# Altium project PR003.PrjPcb (part 7 of 11)

## Sheet Audio_CodeC.SchDoc
size A3; SheetNumber: 13; SheetTotal: 16
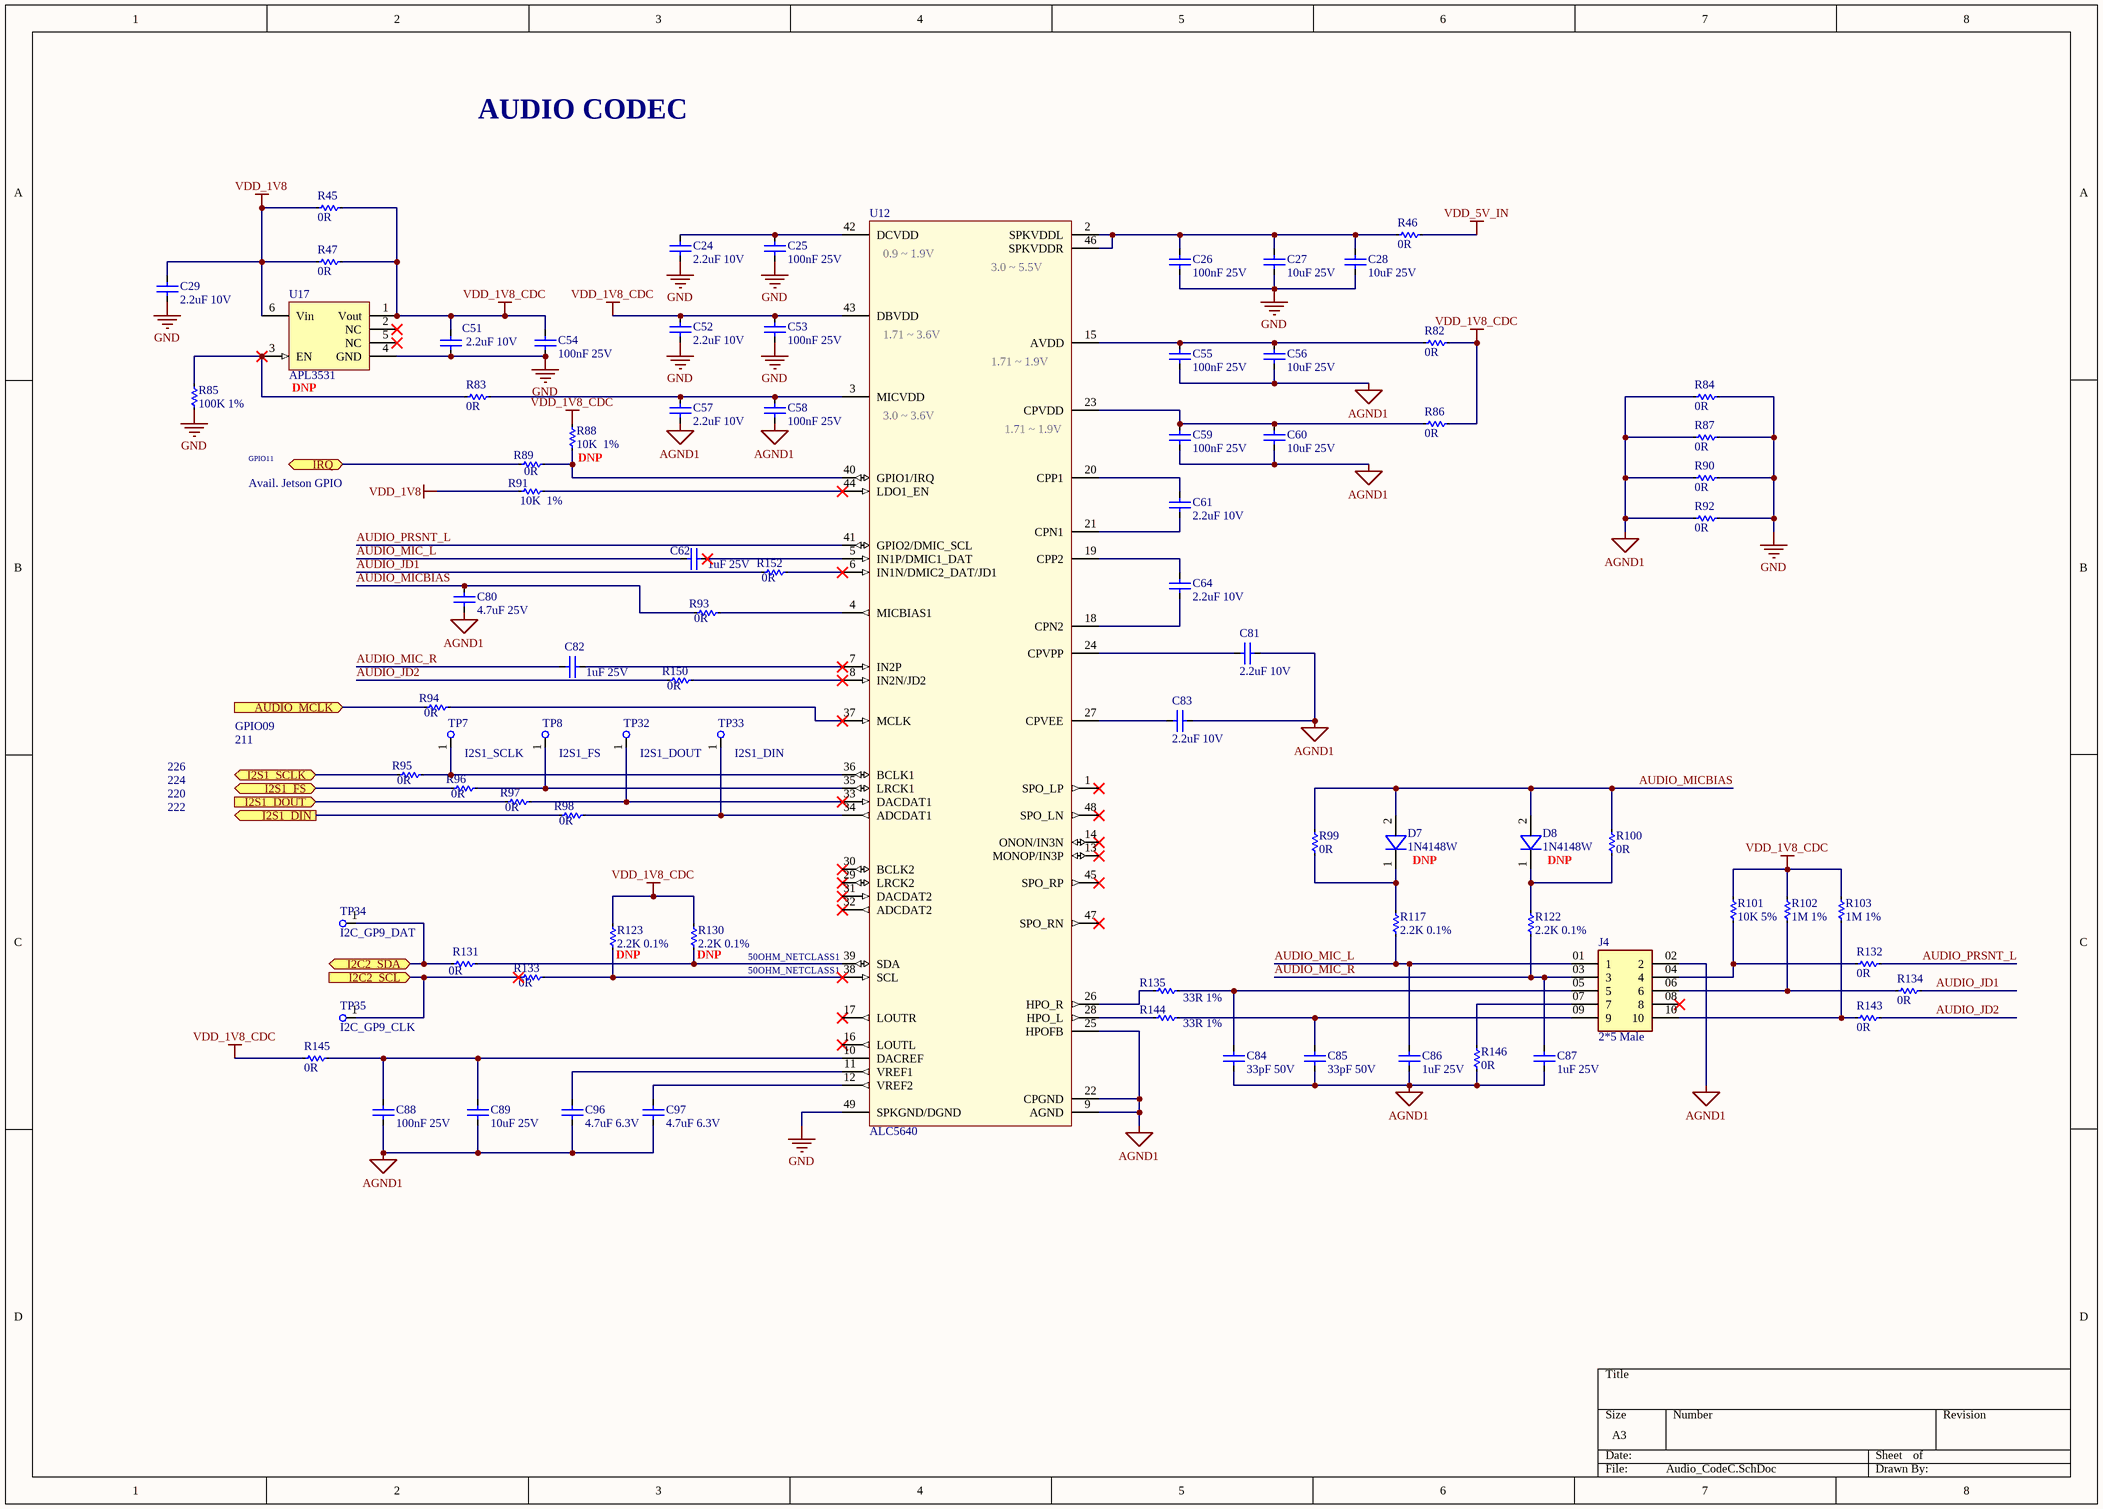
[diagram p9: Audio_CodeC.SchDoc]

### Parts
C24  2.2uF 10V  [C0402]
C25  100nF 25V  [C0402]
C26  100nF 25V  [C0402]
C27  10uF 25V  [C0805]
C28  10uF 25V  [C0805]
C29  2.2uF 10V  [C0402]
C51  2.2uF 10V  [C0402]
C52  2.2uF 10V  [C0402]
C53  100nF 25V  [C0402]
C54  100nF 25V  [C0402]
C55  100nF 25V  [C0402]
C56  10uF 25V  [C0805]
C57  2.2uF 10V  [C0402]
C58  100nF 25V  [C0402]
C59  100nF 25V  [C0402]
C60  10uF 25V  [C0805]
C61  2.2uF 10V  [C0402]
C62  1uF 25V  [C0402]
C64  2.2uF 10V  [C0402]
C80  4.7uF 25V  [C0603]
C81  2.2uF 10V  [C0402]
C82  1uF 25V  [C0402]
C83  2.2uF 10V  [C0402]
C84  33pF 50V  [C0402]
C85  33pF 50V  [C0402]
C86  1uF 25V  [C0402]
C87  1uF 25V  [C0402]
C88  100nF 25V  [C0402]
C89  10uF 25V  [C0805]
C96  4.7uF 6.3V  [C0402]
C97  4.7uF 6.3V  [C0402]
D7  1N4148W  [SOD123F]
D8  1N4148W  [SOD123F]
J4  2*5 Male  [0010977106]
R45  0R  [R0603]
R46  0R  [R0603]
R47  0R  [R0603]
R82  0R  [R0603]
R83  0R  [R0402]
R84  0R  [R0805]
R85  100K 1%  [R0402]
R86  0R  [R0603]
R87  0R  [R0805]
R88  10K  1%  [R0402]
R89  0R  [R0603]
R90  0R  [R0805]
R91  10K  1%  [R0402]
R92  0R  [R0805]
R93  0R  [R0603]
R94  0R  [R0603]
R95  0R  [R0603]
R96  0R  [R0603]
R97  0R  [R0603]
R98  0R  [R0603]
R99  0R  [R0402]
R100  0R  [R0402]
R101  10K 5%  [R0402]
R102  1M 1%  [R0402]
R103  1M 1%  [R0402]
R117  2.2K 0.1%  [R0603]
R122  2.2K 0.1%  [R0603]
R123  2.2K 0.1%  [R0603]
R130  2.2K 0.1%  [R0603]
R131  0R  [R0603]
R132  0R  [R0402]
R133  0R  [R0603]
R134  0R  [R0402]
R135  33R 1%  [R0402]
R143  0R  [R0402]
R144  33R 1%  [R0402]
R145  0R  [R0603]
R146  0R  [R0402]
R150  0R  [R0603]
R152  0R  [R0603]
TP7  I2S1_SCLK  [TestPoint_Pad_D1.0mm]
TP8  I2S1_FS  [TestPoint_Pad_D1.0mm]
TP32  I2S1_DOUT  [TestPoint_Pad_D1.0mm]
TP33  I2S1_DIN  [TestPoint_Pad_D1.0mm]
TP34  I2C_GP9_DAT  [TestPoint_Pad_D1.0mm]
TP35  I2C_GP9_CLK  [TestPoint_Pad_D1.0mm]
U12  ALC5640  [QFN-48 6mm*6mm]
U17  APL3531  [SC-70-6]

### Ports
AUDIO_MCLK (in), I2C2_SCL (in), I2C2_SDA (bidir), I2S1_DIN (out), I2S1_DOUT (in), I2S1_FS (bidir), I2S1_SCLK (bidir), IRQ (bidir)

### Nets
AGND1: C55.1 C56.1 C57.1 C58.1 C59.1 C60.1 C80.1 C81.1 C83.1 C84.1 C85.1 C86.1 C87.1 C88.1 C89.1 C96.1 C97.1 J4.02(2) R84.1 R87.1 R90.1 R92.1 R146.1 U12.9(AGND) U12.22(CPGND) U12.25(HPOFB)
GND: C24.1 C25.1 C26.1 C27.1 C28.1 C29.1 C51.1 C52.1 C53.1 C54.1 R84.2 R85.1 R87.2 R90.2 R92.2 U12.49(SPKGND/DGND) U17.4(GND)
VDD_1V8: C29.2 R45.1 R47.1 R91.2 U17.6(Vin)
VDD_1V8_CDC: C51.2 C52.2 C53.2 C54.2 R45.2 R47.2 R82.2 R86.2 R88.2 R101.2 R102.2 R103.2 R123.2 R130.2 R145.1 U12.43(DBVDD) U17.1(Vout)
VDD_5V_IN: R46.2
AUDIO_JD1: R134.2 R152.1
AUDIO_JD2: R143.2 R150.1
AUDIO_MIC_L: C62.2 C86.2 J4.01(1) R117.1
AUDIO_MIC_R: C82.2 C87.2 J4.03(3) R122.1
AUDIO_MICBIAS: C80.2 D7.2(A) D8.2(A) R93.1 R99.2 R100.2
AUDIO_PRSNT_L: R132.2 U12.41(GPIO2/DMIC_SCL)
I2C2_SCL: R133.1 TP35.1 ; port I2C2_SCL
I2C2_SDA: R131.1 TP34.1 ; port I2C2_SDA
NetC24_2: C24.2 C25.2 U12.42(DCVDD)
NetC26_2: C26.2 C27.2 C28.2 R46.1 U12.2(SPKVDDL) U12.46(SPKVDDR)
NetC55_2: C55.2 C56.2 R82.1 U12.15(AVDD)
NetC57_2: C57.2 C58.2 R83.2 U12.3(MICVDD)
NetC59_2: C59.2 C60.2 R86.1 U12.23(CPVDD)
NetC61_1: C61.1 U12.21(CPN1)
NetC61_2: C61.2 U12.20(CPP1)
NetC62_1: C62.1 U12.5(IN1P/DMIC1_DAT)
NetC64_1: C64.1 U12.18(CPN2)
NetC64_2: C64.2 U12.19(CPP2)
NetC81_2: C81.2 U12.24(CPVPP)
NetC82_1: C82.1 U12.7(IN2P)
NetC83_2: C83.2 U12.27(CPVEE)
NetC84_2: C84.2 J4.05(5) R135.2
NetC85_2: C85.2 J4.09(9) R144.2
NetC88_2: C88.2 C89.2 R145.2 U12.10(DACREF)
NetC96_2: C96.2 U12.11(VREF1)
NetC97_2: C97.2 U12.12(VREF2)
NetD7_1: D7.1(K) R99.1 R117.2
NetD8_1: D8.1(K) R100.1 R122.2
NetJ4_04: J4.04(4) R101.1 R132.1
NetJ4_06: J4.06(6) R102.1 R134.1
NetJ4_07: J4.07(7) R146.2
NetJ4_10: J4.10 R103.1 R143.1
NetJ10_211: R94.1 ; port AUDIO_MCLK
NetJ10_216: R89.1 ; port IRQ
NetJ10_220: R97.1 ; port I2S1_DOUT
NetJ10_222: R98.1 ; port I2S1_DIN
NetJ10_224: R96.1 ; port I2S1_FS
NetJ10_226: R95.1 ; port I2S1_SCLK
NetR83_1: R83.1 R85.2 U17.3(EN)
NetR88_1: R88.1 R89.2 U12.40(GPIO1/IRQ)
NetR91_1: R91.1 U12.44(LDO1_EN)
NetR93_2: R93.2 U12.4(MICBIAS1)
NetR94_2: R94.2 U12.37(MCLK)
NetR95_2: R95.2 TP7.1 U12.36(BCLK1)
NetR96_2: R96.2 TP8.1 U12.35(LRCK1)
NetR97_2: R97.2 TP32.1 U12.33(DACDAT1)
NetR98_2: R98.2 TP33.1 U12.34(ADCDAT1)
NetR123_1: R123.1 R133.2 U12.38(SCL)
NetR130_1: R130.1 R131.2 U12.39(SDA)
NetR135_1: R135.1 U12.26(HPO_R)
NetR144_1: R144.1 U12.28(HPO_L)
NetR150_2: R150.2 U12.8(IN2N/JD2)
NetR152_2: R152.2 U12.6(IN1N/DMIC2_DAT/JD1)

Not connected (* = marked no-connect by the designer): J4 08(8)*; U12 1(SPO_LP)* 13(MONOP/IN3P)* 14(ONON/IN3N)* 16(LOUTL)* 17(LOUTR)* 29(LRCK2)* 30(BCLK2)* 31(DACDAT2)* 32(ADCDAT2)* 45(SPO_RP)* 47(SPO_RN)* 48(SPO_LN)*; U17 2(NC)* 5(NC)*

### Notes on the sheet
- AUDIO CODEC
- (near U17) DNP
- Avail. Jetson GPIO
- GPIO11
- (near R88) DNP
- 226
- 224
- GPIO09
- 211
- 220
- 222
- (near D7) DNP
- (near D8) DNP
- (near R123) DNP
- (near R130) DNP
- 50OHM_NETCLASS1
- (in symbol ALC5640) 0.9 ~ 1.9V; 3.0 ~ 5.5V; 1.71 ~ 3.6V; 1.71 ~ 1.9V; 3.0 ~ 3.6V

### Library data of the parts
C24 C29 C51 C52 C57 C61 C64 C81 C83 = CC0402MRX5R6BB225: 0402 2.2 uF 10 V ±20% Tolerance X5R Multilayer Ceramic Capacitor; Manufacturer: Yageo; Supplier 1: Digi-Key; Manufacturer Part Number: CC0402MRX5R6BB225; RoHS: Yes; Category: Ceramic Capacitors; Stock 1: 190957; Pricing 1: 1=0.10000, 10=0.06400, 50=0.03520, 100=0.02870, 500=0.02050, 1000=0.01611, 2500=0.01464, 5000=0.01347 (USD); Mount: Surface Mount; Case/Package: 0402; Case Code (Metric): 1005; Case Code (Imperial): 0402; Weight: 2.3E-05oz; Min Operating Temperature: -55°C; Max Operating Temperature: 85°C; Packaging: Tape and Reel; Capacitance: 2.2uF; Voltage Rating: 10V; Tolerance: 20%; Dielectric: X5R; Termination: SMD/SMT; Voltage Rating (DC): 10V; Package Quantity: 5000; Length: 0.039inch; Width: 0.02inch; Thickness: 0.022inch; Lead Free: Lead Free; Halogen Free: Halogen Free; RoHS Compliant: Yes; ComponentLink1URL: http://www.mouser.com/ds/2/447/Yageo_UPY-GP_NP0_16V-to-50V_9-358835.pdf?src-supplier=Mouser; ComponentLink1Description: http://www.mouser.com/ds/2/447/Yageo_UPY-GP_NP0_16V-to-50V_9-358835.pdf?src-supplier=Mouser; ComponentLink2URL: http://www.yageo.com/documents/recent/UPY-GPHC_X5R_4V-to-50V_25.pdf?src-supplier=Digi-Key; ComponentLink2Description: http://www.yageo.com/documents/recent/UPY-GPHC_X5R_4V-to-50V_25.pdf?src-supplier=Digi-Key; ComponentLink3URL: https://www.yageo.com/upload/media/product/productsearch/datasheet/mlcc/UPY-GPHC_X5R_4V-to-50V_26.pdf?src-supplier=Digi-Key; ComponentLink3Description: https://www.yageo.com/upload/media/product/productsearch/datasheet/mlcc/UPY-GPHC_X5R_4V-to-50V_26.pdf?src-supplier=Digi-Key; ComponentLink4URL: http://www.yageo.com/exep/pages/download/literatures/ProductSelectionGuide%202014_Final_2.pdf?src-supplier=Digi-Key; ComponentLink4Description: http://www.yageo.com/exep/pages/download/literatures/ProductSelectionGuide%202014_Final_2.pdf?src-supplier=Digi-Key; Supplier Part Number 1: 311-1733-6-ND
C25 C26 C53-C55 C58 C59 = 04023C104KAT2A: as C34 on sheet HDMI_Connector; Supplier 1: Digi-Key; Manufacturer Part Number: 04023C104KAT2A; RoHS: Yes; Category: Ceramic Capacitors; Stock 1: 3248475; Pricing 1: 1=0.10000, 10=0.03300, 50=0.01820, 100=0.01480, 500=0.01060, 1000=0.00833, 2500=0.00758, 5000=0.00697 (USD); Mount: Surface Mount; Case/Package: 0402; Number of Pins: 2; Case Code (Metric): 1005; Case Code (Imperial): 0402; Min Operating Temperature: -55°C; Max Operating Temperature: 125°C; Capacitance: 100nF; Packaging: Cut Tape; Dielectric: X7R; Voltage Rating (DC): 25V; Voltage Rating: 25V; Package Quantity: 1; Termination: SMD/SMT; Voltage: 25V; Series: -; Construction: Flat; Length: 1mm; Width: 1mm; Thickness: 0.022inch; Depth: 0.5mm; Radiation Hardening: No; Reach SVHC Compliant: Yes; Lead Free: Lead Free; RoHS Compliant: Yes; ComponentLink1URL: https://datasheet.ciiva.com/1123/1679506-1123344.pdf?src-supplier=Element14; ComponentLink1Description: https://datasheet.ciiva.com/1123/1679506-1123344.pdf?src-supplier=Element14; ComponentLink2URL: https://datasheet.ciiva.com/7614/cx7r-7614663.pdf?src-supplier=Digi-Key; ComponentLink2Description: https://datasheet.ciiva.com/7614/cx7r-7614663.pdf?src-supplier=Digi-Key; ComponentLink3URL: https://datasheet.ciiva.com/7709/1679506-7709527.pdf?src-supplier=Element14; ComponentLink3Description: https://datasheet.ciiva.com/7709/1679506-7709527.pdf?src-supplier=Element14; ComponentLink4URL: https://datasheet.ciiva.com/6265/cx7r-6265272.pdf?src-supplier=Digi-Key; ComponentLink4Description: https://datasheet.ciiva.com/6265/cx7r-6265272.pdf?src-supplier=Digi-Key; ComponentLink5URL: https://datasheet.ciiva.com/14906/cx7r-14906223.pdf?src-supplier=Digi-Key; ComponentLink5Description: https://datasheet.ciiva.com/14906/cx7r-14906223.pdf?src-supplier=Digi-Key; Supplier Part Number 1: 478-7868-1-ND
C27 C28 C56 C60 = TMK212BBJ106KG-T: as C36 on sheet HDMI_Connector; Supplier 1: Digi-Key; Manufacturer Part Number: TMK212BBJ106KG-T; RoHS: Yes; Category: Ceramic Capacitors; Stock 1: 3515248; Pricing 1: 1=0.18000, 10=0.12400, 50=0.07460, 100=0.06290, 500=0.04306, 1000=0.03810 (USD); Mount: Surface Mount; Case/Package: 0805; Number of Pins: 2; Case Code (Metric): 2012; Case Code (Imperial): 0805; Min Operating Temperature: -55°C; Max Operating Temperature: 85°C; Capacitance: 10uF; Tolerance: 10%; Packaging: Tape and Reel; Voltage Rating (DC): 25V; Package Quantity: 1; Voltage Rating: 25V; Termination: SMD/SMT; Resistor Type: Ceramic; Series: M; Length: 0.079inch; Width: 0.049inch; Height: 1.25mm; Thickness: 0.053inch; Lead Free: Lead Free; Reach SVHC Compliant: Yes; RoHS Compliant: Yes; ComponentLink1URL: https://datasheet.ciiva.com/30062/tmk212bbj106kg-t-30062083.pdf?src-supplier=Onlinecomponents.com; ComponentLink1Description: https://datasheet.ciiva.com/30062/tmk212bbj106kg-t-30062083.pdf?src-supplier=Onlinecomponents.com; ComponentLink2URL: https://datasheet.ciiva.com/7975/1481447-7975820.pdf?src-supplier=Element14; ComponentLink2Description: https://datasheet.ciiva.com/7975/1481447-7975820.pdf?src-supplier=Element14; ComponentLink3URL: https://datasheet.ciiva.com/139/mlcc-all-e-139571.pdf?src-supplier=Digi-Key; ComponentLink3Description: https://datasheet.ciiva.com/139/mlcc-all-e-139571.pdf?src-supplier=Digi-Key; ComponentLink4URL: https://datasheet.ciiva.com/139/mlcc-all-e-139570.pdf?src-supplier=Digi-Key; ComponentLink4Description: https://datasheet.ciiva.com/139/mlcc-all-e-139570.pdf?src-supplier=Digi-Key; ComponentLink5URL: https://datasheet.ciiva.com/139/mlcc-all-e-139572.pdf?src-supplier=Digi-Key; ComponentLink5Description: https://datasheet.ciiva.com/139/mlcc-all-e-139572.pdf?src-supplier=Digi-Key; Supplier Part Number 1: 587-2985-1-ND
C62 C82 C86 C87 = GRM155R61E105MA12D: 0402 1 uF 25 V ±20% Tolerance X5R SMT Multilayer Ceramic Capacitor; Manufacturer: Murata; Supplier 1: Digi-Key; Manufacturer Part Number: GRM155R61E105MA12D; RoHS: Yes; Category: Ceramic Capacitors; Stock 1: 3558409; Pricing 1: 1=0.10000, 10=0.07400, 50=0.04060, 100=0.03320, 500=0.02368, 1000=0.01861, 2500=0.01692, 5000=0.01556 (USD); Mount: Surface Mount; Case/Package: 0402; Case Code (Metric): 1005; Case Code (Imperial): 0402; Weight: 0.000212oz; Min Operating Temperature: -55°C; Max Operating Temperature: 85°C; Capacitance: 1uF; Packaging: Tape and Reel; Voltage Rating: 25V; Tolerance: 20%; Dielectric: X5R; Termination: SMD/SMT; Voltage Rating (DC): 25V; Package Quantity: 10000; Length: 0.039inch; Width: 0.5mm; Height: 0.5mm; Thickness: 0.022inch; Lead Free: Lead Free; RoHS Compliant: Yes; ComponentLink1URL: http://www.mouser.com/ds/2/281/c02e-2905.pdf?src-supplier=Mouser; ComponentLink1Description: http://www.mouser.com/ds/2/281/c02e-2905.pdf?src-supplier=Mouser; ComponentLink2URL: http://search.murata.co.jp/Ceramy/image/img/A01X/G101/ENG/GRM155R61E105MA12-01.pdf?src-supplier=Digi-Key; ComponentLink2Description: http://search.murata.co.jp/Ceramy/image/img/A01X/G101/ENG/GRM155R61E105MA12-01.pdf?src-supplier=Digi-Key; Supplier Part Number 1: 490-10018-1-ND
C80 = GRM188R61E475KE11D: 0603 4.7 uF 25 V ±10 % Tolerance X5R SMT Multilayer Ceramic Capacitor; Manufacturer: Murata; Tolerance: 10%; Supplier 1: Digi-Key; Manufacturer Part Number: GRM188R61E475KE11D; RoHS: Yes; Category: Ceramic Capacitors; Stock 1: 1144167; Pricing 1: 1=0.26000, 10=0.18000, 50=0.12000, 100=0.10200, 500=0.07202, 1000=0.06301 (USD); Mount: Surface Mount; Case/Package: 0603; Case Code (Metric): 1608; Case Code (Imperial): 0603; Material: Ceramic; Min Operating Temperature: -55°C; Max Operating Temperature: 85°C; Package Quantity: 1; Packaging: Cut Tape; Capacitance: 4.7uF; Voltage Rating: 25V; Dielectric: X5R; Voltage: 25V; Voltage Rating (DC): 25V; Series: GRM; Length: 0.063inch; Width: 0.031inch; Height: 0.8mm; Thickness: 0.031inch; Depth: 0.8mm; Reach SVHC Compliant: Yes; Lead Free: Lead Free; RoHS Compliant: Yes; ComponentLink1URL: https://datasheet.ciiva.com/46444/1769893-46444983.pdf?src-supplier=Element14; ComponentLink1Description: https://datasheet.ciiva.com/46444/1769893-46444983.pdf?src-supplier=Element14; ComponentLink2URL: https://datasheet.ciiva.com/46444/1769893-46444982.pdf?src-supplier=Element14; ComponentLink2Description: https://datasheet.ciiva.com/46444/1769893-46444982.pdf?src-supplier=Element14; ComponentLink3URL: https://datasheet.ciiva.com/14891/partnumbering-e-01-14891103.pdf?src-supplier=Digi-Key; ComponentLink3Description: https://datasheet.ciiva.com/14891/partnumbering-e-01-14891103.pdf?src-supplier=Digi-Key; ComponentLink4URL: https://datasheet.ciiva.com/14891/partnumbering-e-01-14891102.pdf?src-supplier=Digi-Key; ComponentLink4Description: https://datasheet.ciiva.com/14891/partnumbering-e-01-14891102.pdf?src-supplier=Digi-Key; Supplier Part Number 1: 490-7203-1-ND
C84 C85 = CC0402JRNPO9BN330: 0402 33 pF 50 V ±5 % Tolerance NP0 SMT Multilayer Ceramic Capacitor; Manufacturer: Yageo; Tolerance: 5%; Dielectric: C0G; Insulation Resistance: 100GR; Supplier 1: Digi-Key; Manufacturer Part Number: CC0402JRNPO9BN330; RoHS: Yes; Category: Ceramic Capacitors; Stock 1: 1010765; Pricing 1: 1=0.10000, 10=0.01900, 50=0.01060, 100=0.00870, 500=0.00618, 1000=0.00486, 2500=0.00442, 5000=0.00407 (USD); Mount: Surface Mount; Case/Package: 0402; Number of Pins: 2; Case Code (Imperial): 0402; Case Code (Metric): 1005; Weight: 2.3E-05oz; Dielectric Material: Ceramic; Min Operating Temperature: -55°C; Max Operating Temperature: 125°C; Capacitance: 33pF; Voltage Rating: 50V; Packaging: Tape and Reel; Voltage Rating (DC): 50V; Package Quantity: 1; Termination: SMD/SMT; Resistor Type: Ceramic; Series: CC; Length: 1mm; Width: 0.02inch; Height: 0.5mm; Thickness: 0.022inch; Depth: 0.5mm; Radiation Hardening: No; Reach SVHC Compliant: Yes; Lead Free: Lead Free; RoHS Compliant: Yes; ComponentLink1URL: https://datasheet.ciiva.com/143/mlccorderingcode-143996.pdf?src-supplier=Digi-Key; ComponentLink1Description: https://datasheet.ciiva.com/143/mlccorderingcode-143996.pdf?src-supplier=Digi-Key; ComponentLink2URL: https://datasheet.ciiva.com/143/mlccorderingcode-143995.pdf?src-supplier=Digi-Key; ComponentLink2Description: https://datasheet.ciiva.com/143/mlccorderingcode-143995.pdf?src-supplier=Digi-Key; ComponentLink3URL: https://datasheet.ciiva.com/143/mlccorderingcode-143997.pdf?src-supplier=Digi-Key; ComponentLink3Description: https://datasheet.ciiva.com/143/mlccorderingcode-143997.pdf?src-supplier=Digi-Key; ComponentLink4URL: https://datasheet.ciiva.com/26862/getdatasheetpartid-403453-26862599.pdf?src-supplier=Verical; ComponentLink4Description: https://datasheet.ciiva.com/26862/getdatasheetpartid-403453-26862599.pdf?src-supplier=Verical; ComponentLink5URL: https://datasheet.ciiva.com/28450/1443161-28450254.pdf?src-supplier=Element14; ComponentLink5Description: https://datasheet.ciiva.com/28450/1443161-28450254.pdf?src-supplier=Element14; ComponentLink6URL: https://datasheet.ciiva.com/8033/1443161-8033611.pdf?src-supplier=Element14; ComponentLink6Description: https://datasheet.ciiva.com/8033/1443161-8033611.pdf?src-supplier=Element14; ComponentLink7URL: https://datasheet.ciiva.com/8033/1443161-8033610.pdf?src-supplier=Element14; ComponentLink7Description: https://datasheet.ciiva.com/8033/1443161-8033610.pdf?src-supplier=Element14; ComponentLink8URL: https://datasheet.ciiva.com/13263/upy-gp-np0-16v-to-50v-8-3714-13263802.pdf?src-supplier=Mouser; ComponentLink8Description: https://datasheet.ciiva.com/13263/upy-gp-np0-16v-to-50v-8-3714-13263802.pdf?src-supplier=Mouser; Supplier Part Number 1: 311-1020-1-ND
C88 = TMK105BJ104KV-F: as C39 on sheet HDMI_Connector; Supplier 1: Digi-Key; Manufacturer Part Number: TMK105BJ104KV-F; RoHS: Yes; Category: Ceramic Capacitors; Stock 1: 11997960; Pricing 1: 1=0.10000, 10=0.03700, 50=0.02000, 100=0.01630, 500=0.01166, 1000=0.00917, 2500=0.00833, 5000=0.00767 (USD); Mount: Surface Mount; Case/Package: 0402; Number of Pins: 2; Case Code (Imperial): 0402; Case Code (Metric): 1005; Weight: 2.3E-05oz; Min Operating Temperature: -55°C; Max Operating Temperature: 85°C; Capacitance: 100nF; Packaging: Tape and Reel; Dielectric: X5R; Voltage Rating (DC): 25V; Voltage Rating: 25V; Package Quantity: 1; Termination: SMD/SMT; Resistor Type: Ceramic; Voltage: 25V; Series: M; Construction: Flat; Length: 1mm; Width: 0.02inch; Height: 0.5mm; Depth: 0.5mm; Thickness: 0.022inch; Reach SVHC Compliant: Yes; Lead Free: Lead Free; Halogen Free: Halogen Free; RoHS Compliant: Yes; Supplier Part Number 1: 587-1456-1-ND
C89 = CL21A106KAYNNNG: Ceramic capacitor SMD-0805 10000nF (10uF) /25V X5R# M +-20% Samsung , RoHS/3000pcs/; Tolerance: 10%; Dielectric: X5R; Supplier 1: Digi-Key; Manufacturer: Samsung; Manufacturer Part Number: CL21A106KAYNNNG; RoHS: Yes; Category: Ceramic Capacitors; Stock 1: 552619; Pricing 1: 1=0.18000, 10=0.12800, 50=0.07280, 100=0.06030, 500=0.04226, 1000=0.03499 (USD); Mount: Surface Mount; Case/Package: 0805; Case Code (Metric): 2012; Case Code (Imperial): 0805; Min Operating Temperature: -55°C; Max Operating Temperature: 85°C; Packaging: Tape and Reel; Capacitance: 10uF; Package Quantity: 3000; Voltage Rating: 25V; Series: CL; Construction: Flat; Length: 2mm; Width: 0.049inch; Height: 1.25mm; Thickness: 0.057inch; Depth: 1.25mm; Radiation Hardening: No; Lead Free: Lead Free; RoHS Compliant: Yes; ComponentLink1URL: https://datasheet.ciiva.com/26920/getdatasheetpartid-660292-26920195.pdf?src-supplier=Verical; ComponentLink1Description: https://datasheet.ciiva.com/26920/getdatasheetpartid-660292-26920195.pdf?src-supplier=Verical; Supplier Part Number 1: 1276-6454-1-ND
C96 C97 = CL05A475KQ5NRNC: CAP CER 4.7UF 6.3V X5R 0402; Manufacturer: Samsung; Tolerance: 10%; Supplier 1: Mouser; Manufacturer Part Number: CL05A475KQ5NRNC; RoHS: Yes; Category: Ceramic Capacitors; Stock 1: 700040; Pricing 1: 1=0.10000, 10=0.03800, 50=0.03800, 100=0.03100, 1000=0.01800, 10000=0.01200 (USD); Mount: Surface Mount; Case/Package: 0402; Case Code (Metric): 1005; Case Code (Imperial): 0402; Contact Plating: Tin; Min Operating Temperature: -55°C; Max Operating Temperature: 85°C; Package Quantity: 1; Packaging: Tape and Reel; Capacitance: 4.7uF; Voltage Rating: 6.3V; Dielectric: X5R; Series: CL; Construction: Flat; Length: 1mm; Width: 0.02inch; Height: 0.5mm; Thickness: 0.022inch; Depth: 0.5mm; Radiation Hardening: No; Lead Free: Lead Free; RoHS Compliant: Yes; ComponentLink1URL: https://datasheet.ciiva.com/25793/cl05a475kq5nrnc-25793634.pdf?src-supplier=Digi-Key; ComponentLink1Description: https://datasheet.ciiva.com/25793/cl05a475kq5nrnc-25793634.pdf?src-supplier=Digi-Key; ComponentLink2URL: https://datasheet.ciiva.com/26838/getdatasheetpartid-353228-26838196.pdf?src-supplier=Verical; ComponentLink2Description: https://datasheet.ciiva.com/26838/getdatasheetpartid-353228-26838196.pdf?src-supplier=Verical; Supplier Part Number 1: 187-CL05A475KQ5NRNC
D7 D8 = 1N4148W: Diode Gen Purp 75V 250MA SOD123; Manufacturer: Sangdest Microelectronics; Supplier 1: Digi-Key; Manufacturer Part Number: 1N4148W; RoHS: No; Category: Uncategorized; Stock 1: 621916; Pricing 1: 1=0.13000, 10=0.11900, 100=0.06480, 500=0.03988, 1000=0.02719 (USD); Supplier Part Number 1: 1655-1N4148WDKR-ND
J4 = 0010977106: 2.54mm Pitch C-Grid Breakaway Header Dual Row Vertical High Temperature 10 Circuits 0.38; Manufacturer: Molex; Supplier 1: Digi-Key; Manufacturer Part Number: 0010977106; RoHS: Yes; Category: Uncategorized; Stock 1: 1321; Pricing 1: 1=2.15000, 10=1.83200, 100=1.51350, 1000=1.19488, 5000=1.05946 (USD); ComponentLink1URL: https://datasheet.ciiva.com/742/010879125-sd-742670.pdf?src-supplier=Digi-Key; ComponentLink1Description: Datasheet; Supplier Part Number 1: WM19414-ND
R45-R47 R82 R86 R89 R93-R98 R131 R133 R145 R150 R152 = CR0603-J/-000ELF: as R172 on sheet Block_UART, I2C, CAN and GPIOs; Supplier 1: Digi-Key; Manufacturer Part Number: CR0603-J/-000ELF; RoHS: Yes; Category: Chip SMD Resistors; Stock 1: 1690954; Pricing 1: 1=0.10000, 10=0.01300, 25=0.00960, 50=0.00720, 100=0.00540, 250=0.00408, 500=0.00328, 1000=0.00241 (USD); Mount: Surface Mount; Case/Package: 0603; Number of Pins: 2; Case Code (Imperial): 0603; Case Code (Metric): 1608; Contact Plating: Tin; Min Operating Temperature: -55°C; Max Operating Temperature: 155°C; Packaging: Tape and Reel; Package Quantity: 5000; Resistor Type: Thick Film; Termination: SMD/SMT; Max Power Dissipation: 100mW; Voltage Rating (DC): 50V; Series: CR0603; Technology: THICK FILM; Construction: Rectangular; Features: Moisture Resistant; Number of Terminations: 2; Length: 1.6mm; Width: 0.8mm; Height: 0.45mm; Depth: 0.8mm; Thickness: 457um; Radiation Hardening: No; Reach SVHC Compliant: Yes; Military Standard: Not; RoHS Compliant: Yes; ComponentLink1URL: https://datasheet.ciiva.com/11809/0900766b80fcdb72-11809586.pdf?src-supplier=RSComponents; ComponentLink1Description: https://datasheet.ciiva.com/11809/0900766b80fcdb72-11809586.pdf?src-supplier=RSComponents; ComponentLink2URL: https://datasheet.ciiva.com/7001/1902866-7001645.pdf?src-supplier=Newark; ComponentLink2Description: https://datasheet.ciiva.com/7001/1902866-7001645.pdf?src-supplier=Newark; ComponentLink3URL: https://datasheet.ciiva.com/7986/691949-7986171.pdf?src-supplier=Element14; ComponentLink3Description: https://datasheet.ciiva.com/7986/691949-7986171.pdf?src-supplier=Element14; ComponentLink4URL: https://datasheet.ciiva.com/7660/1856384-7660956.pdf?src-supplier=Element14; ComponentLink4Description: https://datasheet.ciiva.com/7660/1856384-7660956.pdf?src-supplier=Element14; ComponentLink5URL: https://datasheet.ciiva.com/22693/1902866-22693213.pdf?src-supplier=Element14; ComponentLink5Description: https://datasheet.ciiva.com/22693/1902866-22693213.pdf?src-supplier=Element14; ComponentLink6URL: https://datasheet.ciiva.com/5545/chpreztr-5545708.pdf?src-supplier=Mouser; ComponentLink6Description: https://datasheet.ciiva.com/5545/chpreztr-5545708.pdf?src-supplier=Mouser; ComponentLink7URL: https://datasheet.ciiva.com/16761/70154685-16761515.pdf?src-supplier=Allied+Electronics; ComponentLink7Description: https://datasheet.ciiva.com/16761/70154685-16761515.pdf?src-supplier=Allied+Electronics; ComponentLink8URL: https://datasheet.ciiva.com/30062/159chpreztr-30062601.pdf?src-supplier=Onlinecomponents.com; ComponentLink8Description: https://datasheet.ciiva.com/30062/159chpreztr-30062601.pdf?src-supplier=Onlinecomponents.com; ComponentLink9URL: https://datasheet.ciiva.com/48692/001055497-da-01-en-smd-wid-cr0603-j-000elf-0-0-ohm-1-10w-48692135.pdf?src-supplier=Conrad; ComponentLink9Description: https://datasheet.ciiva.com/48692/001055497-da-01-en-smd-wid-cr0603-j-000elf-0-0-ohm-1-10w-48692135.pdf?src-supplier=Conrad; Supplier Part Number 1: CR0603-J/-000ELFCT-ND
R83 R99 R100 R132 R134 R143 R146 = RC0402FR-070RL: RC Series 0402 0.063 W 0 Ohm Jumper Surface Mount Thick Film Chip Resistor; Manufacturer: Yageo; Tolerance: 1%; Power Rating: 62.5mW; Voltage Rating: 50V; Temperature Coefficient: 200ppm/°C; Max Power Dissipation: 63mW; Supplier 1: Digi-Key; Manufacturer Part Number: RC0402FR-070RL; RoHS: Yes; Category: Chip SMD Resistors; Stock 1: 8989202; Pricing 1: 1=0.10000, 10=0.01200, 25=0.00840, 50=0.00640, 100=0.00480, 250=0.00364, 500=0.00290, 1000=0.00214, 5000=0.00154 (USD); Mount: Surface Mount; Case/Package: 0402; Case Code (Imperial): 0402; Case Code (Metric): 1005; Contact Plating: Tin,Matte; Size Code: 0402; Min Operating Temperature: -55°C; Max Operating Temperature: 155°C; Resistance: 0R; Packaging: Tape and Reel; Resistor Type: Thick Film; Termination: SMD/SMT; Features: Moisture Resistant; Series: RC; Number of Terminations: 2; Length: 1mm; Width: 0.5mm; Height: 0.35mm; Radiation Hardening: No; Lead Free: Lead Free; RoHS Compliant: Yes; ComponentLink1URL: https://datasheet.ciiva.com/8896/pyu-rc0402-51-rohs-l-6-8896149.pdf?src-supplier=Avnet; ComponentLink1Description: https://datasheet.ciiva.com/8896/pyu-rc0402-51-rohs-l-6-8896149.pdf?src-supplier=Avnet; ComponentLink2URL: https://datasheet.ciiva.com/16790/pyu-rc0402-51-rohs-l-6-r-16790444.pdf?src-supplier=Future+Electronics; ComponentLink2Description: https://datasheet.ciiva.com/16790/pyu-rc0402-51-rohs-l-6-r-16790444.pdf?src-supplier=Future+Electronics; Supplier Part Number 1: 311-0.0LRCT-ND
R84 R87 R90 R92 = RC0805JR-070RL: RES SMD 0 OHM JUMPER 1/4W 0805; Manufacturer: Yageo; Resistance: 0mR; Tolerance: 5%; Voltage Rating: 150V; Power Rating: 125mW; Temperature Coefficient: 200ppm/°C; Supplier 1: Digi-Key; Manufacturer Part Number: RC0805JR-070RL; RoHS: Yes; Category: Chip SMD Resistors; Stock 1: 4737344; Pricing 1: 1=0.10000, 10=0.02800, 25=0.02040, 50=0.01560, 100=0.01150, 250=0.00876, 500=0.00702, 1000=0.00517 (USD); Case/Package: 0805; Number of Pins: 2; Case Code (Imperial): 0805; Case Code (Metric): 2012; Contact Plating: Tin,Matte; Size Code: 0805; Min Operating Temperature: -55°C; Max Operating Temperature: 155°C; Packaging: Tape and Reel; Voltage Rating (DC): 150V; Termination: SMD/SMT; Resistor Type: Thick Film; Features: Moisture Resistant; Series: RC; Max Power Dissipation: 125mW; Number of Terminations: 2; Construction: Rectangular; Technology: THICK FILM; Resistance Tolerance: 5%; Length: 2mm; Width: 1.25mm; Height: 0.5mm; Depth: 1.25mm; Radiation Hardening: No; Military Standard: Not; Lead Free: Lead Free; RoHS Compliant: Yes; ComponentLink1URL: https://datasheet.ciiva.com/7941/1738694-7941861.pdf?src-supplier=Element14; ComponentLink1Description: https://datasheet.ciiva.com/7941/1738694-7941861.pdf?src-supplier=Element14; ComponentLink2URL: https://datasheet.ciiva.com/7941/1738694-7941862.pdf?src-supplier=Element14; ComponentLink2Description: https://datasheet.ciiva.com/7941/1738694-7941862.pdf?src-supplier=Element14; ComponentLink3URL: https://datasheet.ciiva.com/7941/1738694-7941863.pdf?src-supplier=Element14; ComponentLink3Description: https://datasheet.ciiva.com/7941/1738694-7941863.pdf?src-supplier=Element14; ComponentLink4URL: https://datasheet.ciiva.com/15190/getdatasheetpartid-330685-15190028.pdf?src-supplier=Verical; ComponentLink4Description: https://datasheet.ciiva.com/15190/getdatasheetpartid-330685-15190028.pdf?src-supplier=Verical; Supplier Part Number 1: 311-0.0ARDKR-ND
R85 = RC0402FR-07100KL: as R57 on sheet HDMI_Connector; Supplier 1: Digi-Key; Manufacturer Part Number: RC0402FR-07100KL; RoHS: Yes; Category: Chip SMD Resistors; Stock 1: 41082272; Pricing 1: 1=0.10000, 10=0.01400, 100=0.00580, 1000=0.00262, 2500=0.00228, 5000=0.00188 (USD); Case/Package: 0402; Case Code (Metric): 1005; Case Code (Imperial): 0402; Min Operating Temperature: -55°C; Max Operating Temperature: 155°C; Tolerance: 1%; Package Quantity: 1; Packaging: Tape and Reel; Resistor Type: Thick Film; Number of Terminations: 2; Termination: SMD/SMT; Max Power Dissipation: 63mW; Working Voltage: 50V; Features: Moisture Resistant; Series: RC; Resistance Tolerance: 1%; Construction: Rectangular; Technology: THICK FILM; Length: 0.039inch; Width: 0.02inch; Height: 0.016inch; Depth: 0.5mm; Reach SVHC Compliant: Yes; Military Standard: Not; Lead Free: Lead Free; RoHS Compliant: Yes; ComponentLink1URL: https://datasheet.ciiva.com/11819/0900766b80c66297-11819452.pdf?src-supplier=RSComponents; ComponentLink1Description: https://datasheet.ciiva.com/11819/0900766b80c66297-11819452.pdf?src-supplier=RSComponents; ComponentLink2URL: https://datasheet.ciiva.com/22747/1018594-22747509.pdf?src-supplier=Element14; ComponentLink2Description: https://datasheet.ciiva.com/22747/1018594-22747509.pdf?src-supplier=Element14; ComponentLink3URL: https://datasheet.ciiva.com/2453/pyu-r-int-thick-7-2453362.pdf?src-supplier=Digi-Key; ComponentLink3Description: https://datasheet.ciiva.com/2453/pyu-r-int-thick-7-2453362.pdf?src-supplier=Digi-Key; ComponentLink4URL: https://datasheet.ciiva.com/2453/pyu-r-int-thick-7-2453363.pdf?src-supplier=Digi-Key; ComponentLink4Description: https://datasheet.ciiva.com/2453/pyu-r-int-thick-7-2453363.pdf?src-supplier=Digi-Key; ComponentLink5URL: https://datasheet.ciiva.com/2453/pyu-r-int-thick-7-2453361.pdf?src-supplier=Digi-Key; ComponentLink5Description: https://datasheet.ciiva.com/2453/pyu-r-int-thick-7-2453361.pdf?src-supplier=Digi-Key; ComponentLink6URL: https://datasheet.ciiva.com/12667/pyu-rc0402-51-rohs-l-6-r-12667930.pdf?src-supplier=Mouser; ComponentLink6Description: https://datasheet.ciiva.com/12667/pyu-rc0402-51-rohs-l-6-r-12667930.pdf?src-supplier=Mouser; ComponentLink7URL: https://datasheet.ciiva.com/15189/getdatasheetpartid-323696-15189334.pdf?src-supplier=Verical; ComponentLink7Description: https://datasheet.ciiva.com/15189/getdatasheetpartid-323696-15189334.pdf?src-supplier=Verical; Supplier Part Number 1: 311-100KLRCT-ND
R88 R91 = RC0402FR-0710KP: as R80 on sheet HDMI_Connector; Supplier 1: Digi-Key; Manufacturer Part Number: RC0402FR-0710KP; RoHS: Yes; Category: Chip SMD Resistors; Stock 1: 1032587; Pricing 1: 1=0.10000, 10=0.03100, 100=0.01280, 1000=0.00573, 2500=0.00497, 5000=0.00411 (USD); Case/Package: 0402; Case Code (Metric): 1005; Case Code (Imperial): 0402; Min Operating Temperature: -55°C; Max Operating Temperature: 155°C; Packaging: Tape and Reel; Resistor Type: Thick Film; Number of Terminations: 2; Tolerance: 1%; Features: Moisture Resistant; Length: 0.039inch; Width: 0.02inch; Height: 0.016inch; RoHS Compliant: Yes; ComponentLink1URL: http://www.yageo.com/NewPortal/yageodocoutput?fileName=/pdf/R-Chip/PYu-RC_51_RoHS_P_0.pdf&src-supplier=Digi-Key; ComponentLink1Description: http://www.yageo.com/NewPortal/yageodocoutput?fileName=/pdf/R-Chip/PYu-RC_51_RoHS_P_0.pdf&src-supplier=Digi-Key; Supplier Part Number 1: YAG1249CT-ND
R101 = RC0402JR-0710KL: as R56 on sheet HDMI_Connector; Supplier 1: Digi-Key; Manufacturer Part Number: RC0402JR-0710KL; RoHS: Yes; Category: Chip SMD Resistors; Stock 1: 41914415; Pricing 1: 1=0.10000, 10=0.01200, 100=0.00480, 1000=0.00214, 2500=0.00186, 5000=0.00154 (USD); Case/Package: 0402; Case Code (Metric): 1005; Case Code (Imperial): 0402; Size Code: 0402; Min Operating Temperature: -55°C; Max Operating Temperature: 155°C; Packaging: Tape and Reel; Tolerance: 5%; Package Quantity: 1; Resistor Type: Thick Film; Number of Terminations: 2; Termination: SMD/SMT; Features: Moisture Resistant; Series: RC; Resistance Tolerance: 5%; Construction: Rectangular; Length: 0.039inch; Width: 0.02inch; Height: 0.016inch; Depth: 0.5mm; Military Standard: Not; Lead Free: Lead Free; RoHS Compliant: Yes; ComponentLink1URL: https://datasheet.ciiva.com/2452/pyu-r-int-thick-7-2452627.pdf?src-supplier=Digi-Key; ComponentLink1Description: https://datasheet.ciiva.com/2452/pyu-r-int-thick-7-2452627.pdf?src-supplier=Digi-Key; ComponentLink2URL: https://datasheet.ciiva.com/2452/pyu-r-int-thick-7-2452628.pdf?src-supplier=Digi-Key; ComponentLink2Description: https://datasheet.ciiva.com/2452/pyu-r-int-thick-7-2452628.pdf?src-supplier=Digi-Key; ComponentLink3URL: https://datasheet.ciiva.com/2452/pyu-r-int-thick-7-2452626.pdf?src-supplier=Digi-Key; ComponentLink3Description: https://datasheet.ciiva.com/2452/pyu-r-int-thick-7-2452626.pdf?src-supplier=Digi-Key; Supplier Part Number 1: 311-10KJRCT-ND
R102 R103 = AC0402FR-071ML: RES SMD 1M OHM 1% 1/16W 0402; Manufacturer: Yageo; Power Rating: 62.5mW; Resistance: 1MR; Voltage Rating: 50V; Temperature Coefficient: 100ppm/°C; Max Power Dissipation: 63mW; Supplier 1: Digi-Key; Manufacturer Part Number: AC0402FR-071ML; RoHS: Yes; Category: Chip SMD Resistors; Stock 1: 684587; Pricing 1: 1=0.10000, 10=0.01900, 100=0.00790, 1000=0.00353, 2500=0.00307, 5000=0.00253 (USD); Case/Package: 0402; Case Code (Imperial): 0402; Case Code (Metric): 1005; Size Code: 0402; Min Operating Temperature: -55°C; Max Operating Temperature: 155°C; Packaging: Tape and Reel; Tolerance: 1%; Termination: SMD/SMT; Resistor Type: Thick Film; Number of Terminations: 2; Features: Moisture Resistant,Automotive AEC-Q200; Series: AC; Construction: Rectangular; Length: 1mm; Width: 0.5mm; Height: 0.015inch; Depth: 0.5mm; Military Standard: Not; Lead Free: Lead Free; RoHS Compliant: Yes; ComponentLink1URL: http://www.yageo.com/documents/recent/PYu-AC_51_RoHS_L_2.pdf?src-supplier=Mouser; ComponentLink1Description: http://www.yageo.com/documents/recent/PYu-AC_51_RoHS_L_2.pdf?src-supplier=Mouser; ComponentLink2URL: http://www.yageo.com/documents/recent/PYu-AC_51_RoHS_L_2_revised.pdf?src-supplier=Future+Electronics; ComponentLink2Description: http://www.yageo.com/documents/recent/PYu-AC_51_RoHS_L_2_revised.pdf?src-supplier=Future+Electronics; ComponentLink3URL: http://www.yageo.com/NewPortal/yageodocoutput?fileName=/pdf/R-Chip/PYu-AC_51_RoHS_L_6.pdf&src-supplier=Digi-Key; ComponentLink3Description: http://www.yageo.com/NewPortal/yageodocoutput?fileName=/pdf/R-Chip/PYu-AC_51_RoHS_L_6.pdf&src-supplier=Digi-Key; Supplier Part Number 1: YAG3450CT-ND
R117 R122 R123 R130 = CPF0603B2K2E1: as R41 on sheet Block_UART, I2C, CAN and GPIOs; Supplier 1: Digi-Key; Manufacturer Part Number: CPF0603B2K2E1; RoHS: Yes; Category: Chip SMD Resistors; Stock 1: 150750; Pricing 1: 1=0.69000, 10=0.49000, 100=0.25450, 500=0.17622 (USD); Mount: Surface Mount; Case/Package: 0603; Number of Pins: 2; Case Code (Imperial): 0603; Case Code (Metric): 1608; Weight: 7.1E-05oz; Min Operating Temperature: -55°C; Max Operating Temperature: 155°C; Tolerance: 0.1%; Packaging: Tape and Reel; Resistor Type: Thin Film; Package Quantity: 1000; Termination: Solder; Temperature Coefficient: 25ppm/°C; Number of Terminations: 2; Series: CPF; Resistance Tolerance: 0.1%; Length: 1.55mm; Width: 0.8mm; Height: 0.45mm; Radiation Hardening: No; Reach SVHC Compliant: Yes; ELV: Compliant; RoHS Compliant: Yes; ComponentLink1URL: https://datasheet.ciiva.com/7789/eng-ds-1773200-j-7789503.pdf?src-supplier=Element14; ComponentLink1Description: https://datasheet.ciiva.com/7789/eng-ds-1773200-j-7789503.pdf?src-supplier=Element14; Supplier Part Number 1: A103077DKR-ND
R135 R144 = RC0402FR-0733RL: Res Thick Film 0402 33 Ohm 1% 0.063W(1/16W) ±100ppm/°C Pad SMD T/R; Manufacturer: Yageo; Power Rating: 62.5mW; Voltage Rating: 50V; Max Power Dissipation: 63mW; Supplier 1: Future Electronics; Manufacturer Part Number: RC0402FR-0733RL; RoHS: Yes; Category: Chip SMD Resistors; Stock 1: 14690000; Pricing 1: 10000=0.00100, 50000=0.00090, 200000=0.00090, 300000=0.00080, 750000=0.00090, 1000000=0.00080, 2000000=0.00090, 3000000=0.00070, 7500000=0.00080 (USD); Case/Package: 0402; Number of Pins: 2; Case Code (Imperial): 0402; Case Code (Metric): 1005; Size Code: 0402; Min Operating Temperature: -55°C; Max Operating Temperature: 155°C; Resistance: 33R; Tolerance: 1%; Packaging: Tape and Reel; Termination: SMD/SMT; Resistor Type: Thick Film; Temperature Coefficient: 100ppm/°C; Features: Moisture Resistant; Series: RC; Number of Terminations: 2; Resistance Tolerance: 1%; Construction: Rectangular; Voltage Rating (DC): 50V; Package Quantity: 10000; Technology: THICK FILM; Length: 1mm; Width: 0.5mm; Height: 0.35mm; Depth: 0.5mm; Military Standard: Not; Lead Free: Lead Free; RoHS Compliant: Yes; ComponentLink1URL: https://datasheet.ciiva.com/24070/pyu-rc0402-51-rohs-l-6-r-8721-24070077.pdf?src-supplier=Mouser; ComponentLink1Description: https://datasheet.ciiva.com/24070/pyu-rc0402-51-rohs-l-6-r-8721-24070077.pdf?src-supplier=Mouser; ComponentLink2URL: https://datasheet.ciiva.com/7849/1018594-7849967.pdf?src-supplier=Element14; ComponentLink2Description: https://datasheet.ciiva.com/7849/1018594-7849967.pdf?src-supplier=Element14; ComponentLink3URL: https://datasheet.ciiva.com/7849/1018594-7849966.pdf?src-supplier=Element14; ComponentLink3Description: https://datasheet.ciiva.com/7849/1018594-7849966.pdf?src-supplier=Element14; ComponentLink4URL: https://datasheet.ciiva.com/15189/getdatasheetpartid-329253-15189431.pdf?src-supplier=Verical; ComponentLink4Description: https://datasheet.ciiva.com/15189/getdatasheetpartid-329253-15189431.pdf?src-supplier=Verical; ComponentLink5URL: https://datasheet.ciiva.com/17070/pyu-rc0402-51-rohs-l-6-r-17070335.pdf?src-supplier=Future+Electronics; ComponentLink5Description: https://datasheet.ciiva.com/17070/pyu-rc0402-51-rohs-l-6-r-17070335.pdf?src-supplier=Future+Electronics; Supplier Part Number 1: 5105600
TP7 TP8 TP32-TP35 = TestPoint_D1mm
U12 = ALC5640: The ALC5640 is a high performance, low power, dual I2S interface audio CODEC. Dual I2S interface can connect to different devices and let the ALC5640 to be an Audio Hub.; ComponentLink1Description: Datasheet; ComponentLink1URL: https://www.t-firefly.com/download/Firefly-RK3399/docs/Chip%20Specifications/ALC5640-VB%20DataSheet_0.91.pdf
U17 = APL3531: The APL3531 is a power-distribution switch with some / protection functions that can deliver current up to 1A.; ComponentLink1Description: Datasheet; ComponentLink1URL: https://datasheetspdf.com/pdf-file/1448993/ANPEC/APL3531/1